# EAGLE schematic motordDrive_BreakOut (EAGLE 9.3.1)
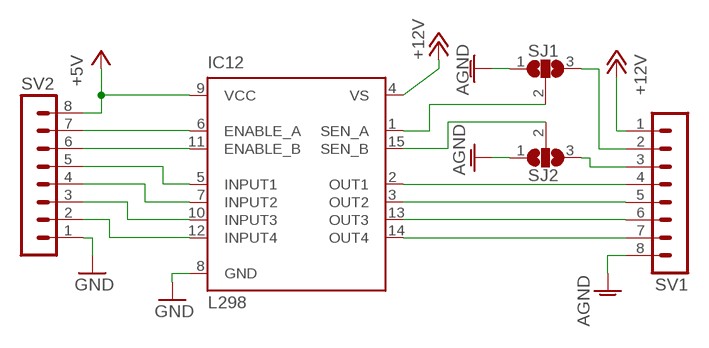
[diagram p0: schematic, sheet 1]

## Parts
IC12  L298  [MULTIWATT-15]
SJ1  SJ2WW  [SJ_2W]
SJ2  SJ2WW  [SJ_2W]
SV1  MA08-1  [MA08-1]
SV2  MA08-1  [MA08-1]

## Nets
+5V: IC12.9(VCC) SV2.8
+12V: IC12.4(VS) SV1.1
AGND: SJ1.1 SJ2.1 SV1.8
GND: IC12.8(GND) SV2.1
N$1: IC12.14(OUT4) SV1.7
N$2: IC12.13(OUT3) SV1.6
N$3: IC12.2(OUT1) SV1.4
N$4: IC12.3(OUT2) SV1.5
N$5: IC12.1(SEN_A) SJ1.2
N$6: IC12.15(SEN_B) SJ2.2
N$7: IC12.6(ENABLE_A) SV2.7
N$8: IC12.11(ENABLE_B) SV2.6
N$9: IC12.5(INPUT1) SV2.5
N$10: IC12.7(INPUT2) SV2.4
N$11: IC12.10(INPUT3) SV2.3
N$12: IC12.12(INPUT4) SV2.2
N$13: SJ1.3 SV1.2
N$14: SJ2.3 SV1.3

## Library data of the parts
IC12 = st-microelectronics:L298: DUAL FULL-BRIDGE DRIVER; MPN: L298N; OC_FARNELL: 1589425; OC_NEWARK: 32M1527
SJ1 SJ2 = jumper:SJ2W: SMD solder JUMPER
SV1 SV2 = con-lstb:MA08-1: PIN HEADER; OC_FARNELL: unknown; OC_NEWARK: unknown